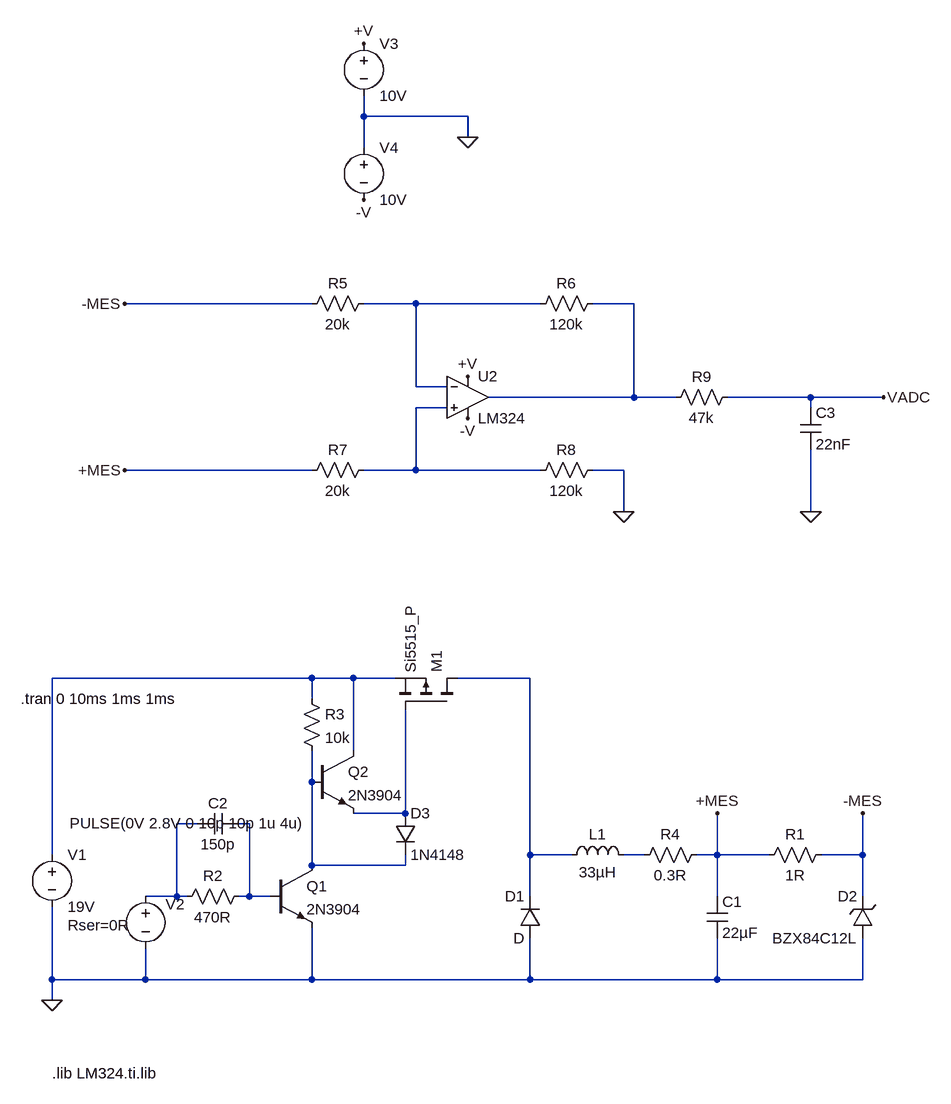
[diagram p0: schematic led_driver_3.asc]
led_driver_3.asc, the LTspice schematic file:
Version 4
SHEET 1 1816 680
WIRE 48 -1040 48 -1072
WIRE 208 -1040 48 -1040
WIRE 208 -1008 208 -1040
WIRE 48 -992 48 -1040
WIRE -32 -752 -320 -752
WIRE 128 -752 48 -752
WIRE 320 -752 128 -752
WIRE 464 -752 400 -752
WIRE 128 -624 128 -752
WIRE 176 -624 128 -624
WIRE 464 -608 464 -752
WIRE 464 -608 240 -608
WIRE 528 -608 464 -608
WIRE 736 -608 608 -608
WIRE 848 -608 736 -608
WIRE 176 -592 128 -592
WIRE 736 -592 736 -608
WIRE -32 -496 -320 -496
WIRE 128 -496 128 -592
WIRE 128 -496 48 -496
WIRE 320 -496 128 -496
WIRE 448 -496 400 -496
WIRE 448 -432 448 -496
WIRE 736 -432 736 -528
WIRE -32 -176 -432 -176
WIRE 32 -176 -32 -176
WIRE 96 -176 32 -176
WIRE 304 -176 192 -176
WIRE -32 -144 -32 -176
WIRE 32 -64 32 -176
WIRE -32 -16 -32 -64
WIRE 112 32 112 -128
WIRE 112 32 32 32
WIRE -208 48 -240 48
WIRE -128 48 -144 48
WIRE -432 96 -432 -176
WIRE 304 96 304 -176
WIRE 368 96 304 96
WIRE 480 96 448 96
WIRE 592 96 592 32
WIRE 592 96 560 96
WIRE 672 96 592 96
WIRE 816 96 816 32
WIRE 816 96 752 96
WIRE -32 112 -32 -16
WIRE 112 112 112 96
WIRE 112 112 -32 112
WIRE -240 160 -240 48
WIRE -240 160 -288 160
WIRE -224 160 -240 160
WIRE -128 160 -128 48
WIRE -128 160 -144 160
WIRE -96 160 -128 160
WIRE 304 160 304 96
WIRE 592 160 592 96
WIRE 816 160 816 96
WIRE -432 288 -432 176
WIRE -288 288 -288 240
WIRE -288 288 -432 288
WIRE -32 288 -32 208
WIRE -32 288 -288 288
WIRE 304 288 304 224
WIRE 304 288 -32 288
WIRE 592 288 592 224
WIRE 592 288 304 288
WIRE 816 288 816 224
WIRE 816 288 592 288
WIRE -432 320 -432 288
FLAG -432 320 0
FLAG 448 -432 0
FLAG 848 -608 VADC
FLAG 592 32 +MES
FLAG 816 32 -MES
FLAG -320 -752 -MES
FLAG -320 -496 +MES
FLAG 208 -1008 0
FLAG 208 -640 +V
FLAG 208 -576 -V
FLAG 48 -1152 +V
FLAG 48 -912 -V
FLAG 736 -432 0
SYMBOL voltage -432 80 R0
WINDOW 123 0 0 Left 2
WINDOW 39 24 124 Left 2
SYMATTR SpiceLine Rser=0R
SYMATTR InstName V1
SYMATTR Value 19V
SYMBOL cap 576 160 R0
SYMATTR InstName C1
SYMATTR Value 22µF
SYMBOL ind 352 112 R270
WINDOW 0 32 56 VTop 2
WINDOW 3 5 56 VBottom 2
SYMATTR InstName L1
SYMATTR Value 33µH
SYMBOL npn -96 112 R0
SYMATTR InstName Q1
SYMATTR Value 2N3904
SYMBOL pmos 192 -128 M270
SYMATTR InstName M1
SYMATTR Value Si5515_P
SYMBOL res -128 144 R90
WINDOW 0 0 56 VBottom 2
WINDOW 3 32 56 VTop 2
SYMATTR InstName R2
SYMATTR Value 470R
SYMBOL cap -144 32 R90
WINDOW 0 0 32 VBottom 2
WINDOW 3 32 32 VTop 2
SYMATTR InstName C2
SYMATTR Value 150p
SYMBOL voltage -288 144 R0
WINDOW 3 -117 -97 Left 2
WINDOW 123 0 0 Left 2
WINDOW 39 0 0 Left 2
WINDOW 0 31 28 Left 2
SYMATTR Value PULSE(0V 2.8V 0 10p 10p 1u 4u)
SYMATTR InstName V2
SYMBOL res -48 -160 R0
SYMATTR InstName R3
SYMATTR Value 10k
SYMBOL npn -32 -64 R0
SYMATTR InstName Q2
SYMATTR Value 2N3904
SYMBOL diode 96 32 R0
SYMATTR InstName D3
SYMATTR Value 1N4148
SYMBOL res 576 80 R90
WINDOW 0 0 56 VBottom 2
WINDOW 3 32 56 VTop 2
SYMATTR InstName R4
SYMATTR Value 0.3R
SYMBOL diode 320 224 R180
WINDOW 0 24 64 Left 2
WINDOW 3 24 0 Left 2
SYMATTR InstName D1
SYMBOL res 768 80 R90
WINDOW 0 0 56 VBottom 2
WINDOW 3 32 56 VTop 2
SYMATTR InstName R1
SYMATTR Value 1R
SYMBOL zener 832 224 R180
WINDOW 0 24 64 Left 2
WINDOW 3 24 0 Left 2
SYMATTR InstName D2
SYMATTR Value BZX84C12L
SYMBOL res 64 -768 R90
WINDOW 0 0 56 VBottom 2
WINDOW 3 32 56 VTop 2
SYMATTR InstName R5
SYMATTR Value 20k
SYMBOL res 416 -768 R90
WINDOW 0 0 56 VBottom 2
WINDOW 3 32 56 VTop 2
SYMATTR InstName R6
SYMATTR Value 120k
SYMBOL res 64 -512 R90
WINDOW 0 0 56 VBottom 2
WINDOW 3 32 56 VTop 2
SYMATTR InstName R7
SYMATTR Value 20k
SYMBOL res 416 -512 R90
WINDOW 0 0 56 VBottom 2
WINDOW 3 32 56 VTop 2
SYMATTR InstName R8
SYMATTR Value 120k
SYMBOL voltage 48 -1168 R0
WINDOW 123 0 0 Left 2
WINDOW 39 0 0 Left 2
SYMATTR InstName V3
SYMATTR Value 10V
SYMBOL voltage 48 -1008 R0
WINDOW 123 0 0 Left 2
WINDOW 39 0 0 Left 2
SYMATTR InstName V4
SYMATTR Value 10V
SYMBOL res 624 -624 R90
WINDOW 0 0 56 VBottom 2
WINDOW 3 32 56 VTop 2
SYMATTR InstName R9
SYMATTR Value 47k
SYMBOL cap 720 -592 R0
SYMATTR InstName C3
SYMATTR Value 22nF
SYMBOL Opamps\\opamp2 208 -672 R0
SYMATTR InstName U2
SYMATTR Value LM324
TEXT -480 -144 Left 2 !.tran 0 10ms 1ms 1ms
TEXT -432 432 Left 2 !.lib LM324.ti.lib

The netlist it stands for:
* led_driver_3.asc
V1 N004 0 19V Rser=0R
C1 +MES 0 22µF
L1 N005 N010 33µH
Q1 N006 N009 0 0 2N3904
M1 N005 N007 N004 N004 Si5515_P
R2 N009 N008 470R
C2 N009 N008 150p
V2 N008 0 PULSE(0V 2.8V 0 10p 10p 1u 4u)
R3 N004 N006 10k
Q2 N004 N006 N007 0 2N3904
D3 N007 N006 1N4148
R4 +MES N010 0.3R
D1 0 N005 D
R1 -MES +MES 1R
D2 0 -MES BZX84C12L
R5 N001 -MES 20k
R6 N002 N001 120k
R7 N003 +MES 20k
R8 0 N003 120k
V3 +V 0 10V
V4 0 -V 10V
R9 VADC N002 47k
C3 VADC 0 22nF
XU2 N003 N001 +V -V N002 LM324  ; pins In+ In- V+ V- OUT
.model D D
.lib standard.dio
.model NPN NPN
.model PNP PNP
.lib standard.bjt
.model NMOS NMOS
.model PMOS PMOS
.lib standard.mos
.tran 0 10ms 1ms 1ms
.lib LM324.ti.lib
.backanno
.end